# EAGLE design MP2307 (EAGLE 9.5.2)
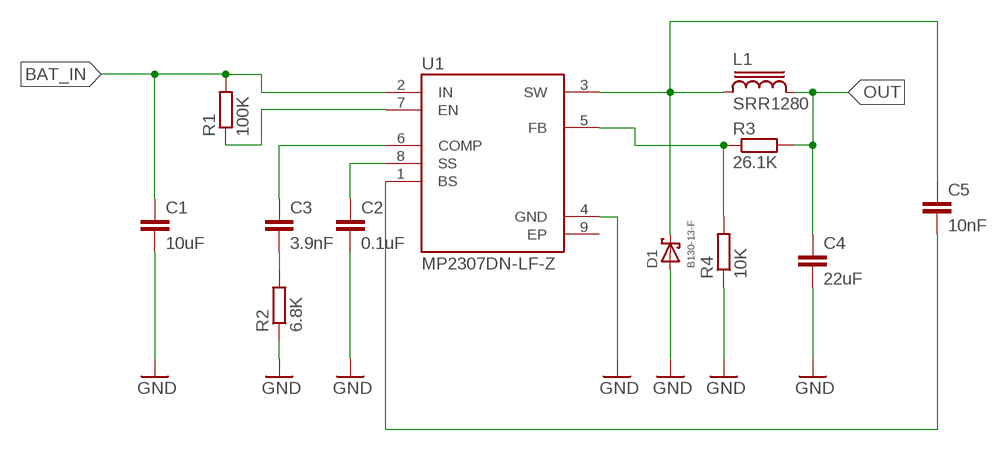
[diagram p0: schematic, sheet 1]

## Parts
C1  10uF  C-EUC0805  [C0805]
C2  0.1uF  C-EUC0805  [C0805]
C3  3.9nF  C-EUC0805  [C0805]
C4  22uF  C-EUC0805  [C0805]
C5  10nF  C-EUC0805  [C0805]
D1  B130-13-F  [SMA]
L1  SRR1280  [SRR1280]
R1  100K  R-EU_R0805  [R0805]
R2  6.8K  R-EU_R0805  [R0805]
R3  26.1K  R-EU_R0805  [R0805]
R4  10K  R-EU_R0805  [R0805]
U1  MP2307DN-LF-Z  [SOIC127P600X170-9N]

## Nets
BAT_IN: C1.1 R1.2 U1.2(IN)
GND: C1.2 C2.2 C4.2 D1.A R2.1 R4.1 U1.4(GND)
N$1: C2.1 U1.8(SS)
N$2: R1.1 U1.7(EN)
N$3: C3.2 R2.2
N$4: C3.1 U1.6(COMP)
N$5: C5.1 D1.C L1.1 U1.3(SW)
N$6: R3.1 R4.2 U1.5(FB)
N$7: C5.2 U1.1(BS)
OUT: C4.1 L1.2 R3.2

## Power pins joined to a net without a drawn wire
EP: U1.9(EP)

## Library data of the parts
C1-C5 = rcl:C-EU: CAPACITOR, European symbol; SPICEPREFIX: C
D1 = B130-13-F:B130-13-F; AVAILABILITY: Unavailable; DESCRIPTION: Diode Schottky 30V 1A Surface Mount SMA; MF: Multicomp; MP: B130-13-F; PACKAGE: DO-214 Multicomp; PRICE: None
L1 = inductor-bourns:SRR1280: POWER INDUCTOR
R1-R4 = rcl:R-EU_: RESISTOR, European symbol; SPICEPREFIX: R
U1 = MP2307DN-LF-Z:MP2307DN-LF-Z: MP2307 Series 23 V 3 A 380 KHz Synchronous Rectified Step-Down Converter-SOIC-8; AVAILABILITY: Unavailable; DESCRIPTION: Buck Switching Regulator IC Positive Adjustable 0.925V 1 Output 3A 8-SOIC _0.154, 3.90mm Width_ Exposed Pad; MF: Monolithic Power; MP: MP2307DN-LF-Z; PACKAGE: SOIC-8 Monolithic Power; PRICE: None

## Board
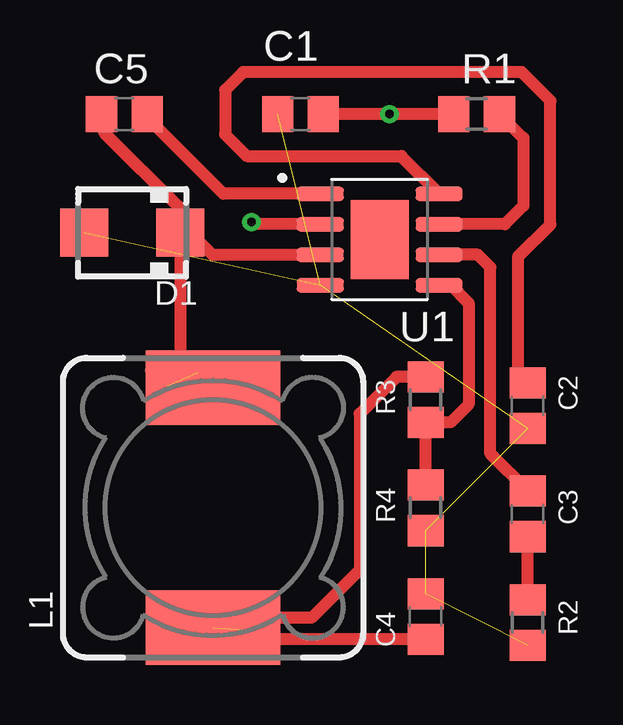
[diagram p1: board, top side]
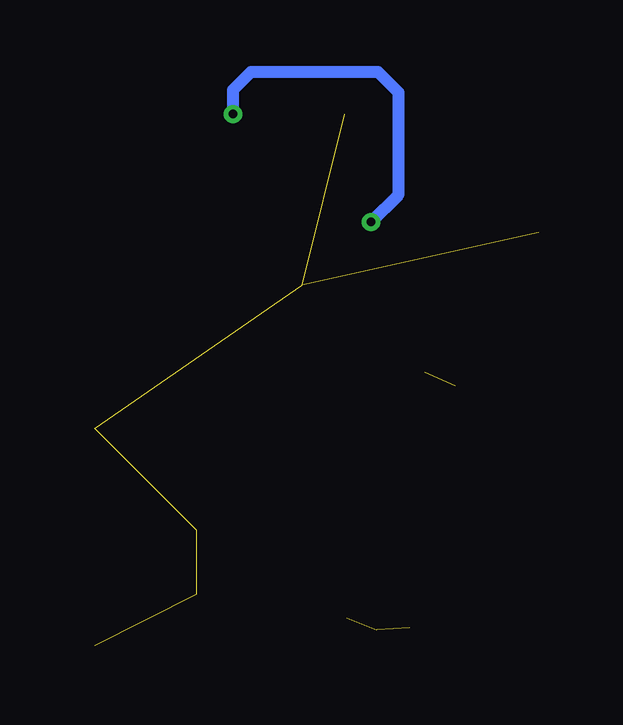
[diagram p2: board, bottom side, seen from below]

No outline drawn. Coordinates in mm, seen from the top.
Copper layers (1*16): Top 0.035mm / dielectric 1.5mm / Bottom 0.035mm
Design rules "default": minimum track width 6mil, minimum drill 0.35mm, track to track 6mil, track to pad 6mil, pad to pad 6mil, via to via 6mil, smd to smd 6mil, copper to edge 40mil, drill to drill 6mil, minimum pad ring 10mil, minimum via ring 8mil, stop-mask expansion 4mil, vias tented up to drill 0mil, thermal gap 10mil

### Footprints (pad centres in the part's own frame; a part is rotated, then mirrored left to right if it is on the bottom)
C0805 = smd 1.3 x 1.5: 1 -0.95,0; 2 0.95,0
SMA = smd 2 x 2: A 2,0; C -2,0
SRR1280 = smd 5.6 x 3.1: 1 0.635,5; 2 0.635,-5
R0805 = smd 1.3 x 1.5: 1 -0.95,0; 2 0.95,0
SOIC127P600X170-9N = smd 1.97 x 0.6: 1 -2.475,1.905; 2 -2.475,0.635; 3 -2.475,-0.635; 4 -2.475,-1.905; 5 2.475,-1.905; 6 2.475,-0.635; 7 2.475,0.635; 8 2.475,1.905 | smd 2.41 x 3.3: 9 0,0

### Placement (x,y rotation side)
C1  20.79,38 180 top
C2  30.25,25.84 270 top
C3  30.25,21.34 270 top
C4  26,17.05 90 top
C5  13.45,38 0 top
D1  13.77,33.05 180 top
L1  16.51,21.59 0 top
R1  28.13,38 180 top
R2  30.25,16.8 90 top
R3  26,26.09 90 top
R4  26,21.59 90 top
U1  24.09,32.77 0 top

### Tracks (layer width: path | path; a pad name or v marks a point on that pad's centre or on a via)
BAT_IN  (via drill 0.35)
  Top 0.508: R1.2 v24.5,38 C1.1 | U1.2 18.84,33.41 v18.75,33.5
  Bottom 0.508: v18.75,33.5 17.6,34.65 17.6,38.9 18.45,39.75 23.75,39.75 24.5,39 v24.5,38
GND  (6 unrouted)
N$1
  Top 0.508: C2.1 29.85,27.2 29.85,32.05 31.2,33.4 31.2,38.55 30,39.75 18.4,39.75 17.65,39 17.65,37.15 18.55,36.25 24.99,36.25 U1.8
N$2
  Top 0.508: R1.1 30.08,37 30.08,34.18 29.3,33.41 U1.7
N$3
  Top 0.508: R2.2 C3.2
N$4
  Top 0.508: U1.6 28.18,32.13 28.7,31.62 28.7,23.84 C3.1
N$5  (1 unrouted)
  Top 0.508: 16.51,27.23 L1.1 16.59,26.59 16,26 15.77,26.23 D1.C | C5.1 12.6,37.9 12.6,37.25 15.77,34.08 D1.C | D1.C 16.2,33.05 17.11,32.13 U1.3
  Top 0.61: 15.24,26.67 14.61,27.3
N$6
  Top 0.508: R4.2 R3.1 27.05,25.14 27.8,25.9 27.8,30.13 27.07,30.86 U1.5 25.86,30.86
N$7
  Top 0.508: U1.1 17.57,34.67 14.4,37.85 C5.2
OUT  (2 unrouted)
  Top 0.508: C4.1 18.9,16.1 18.5,16.5 | R3.2 24.8,27.05 23.25,25.5 23.25,19 21.25,17 19.75,17